# Altium schematic sheet GU906_HW_V1.0.SchDoc
size A4
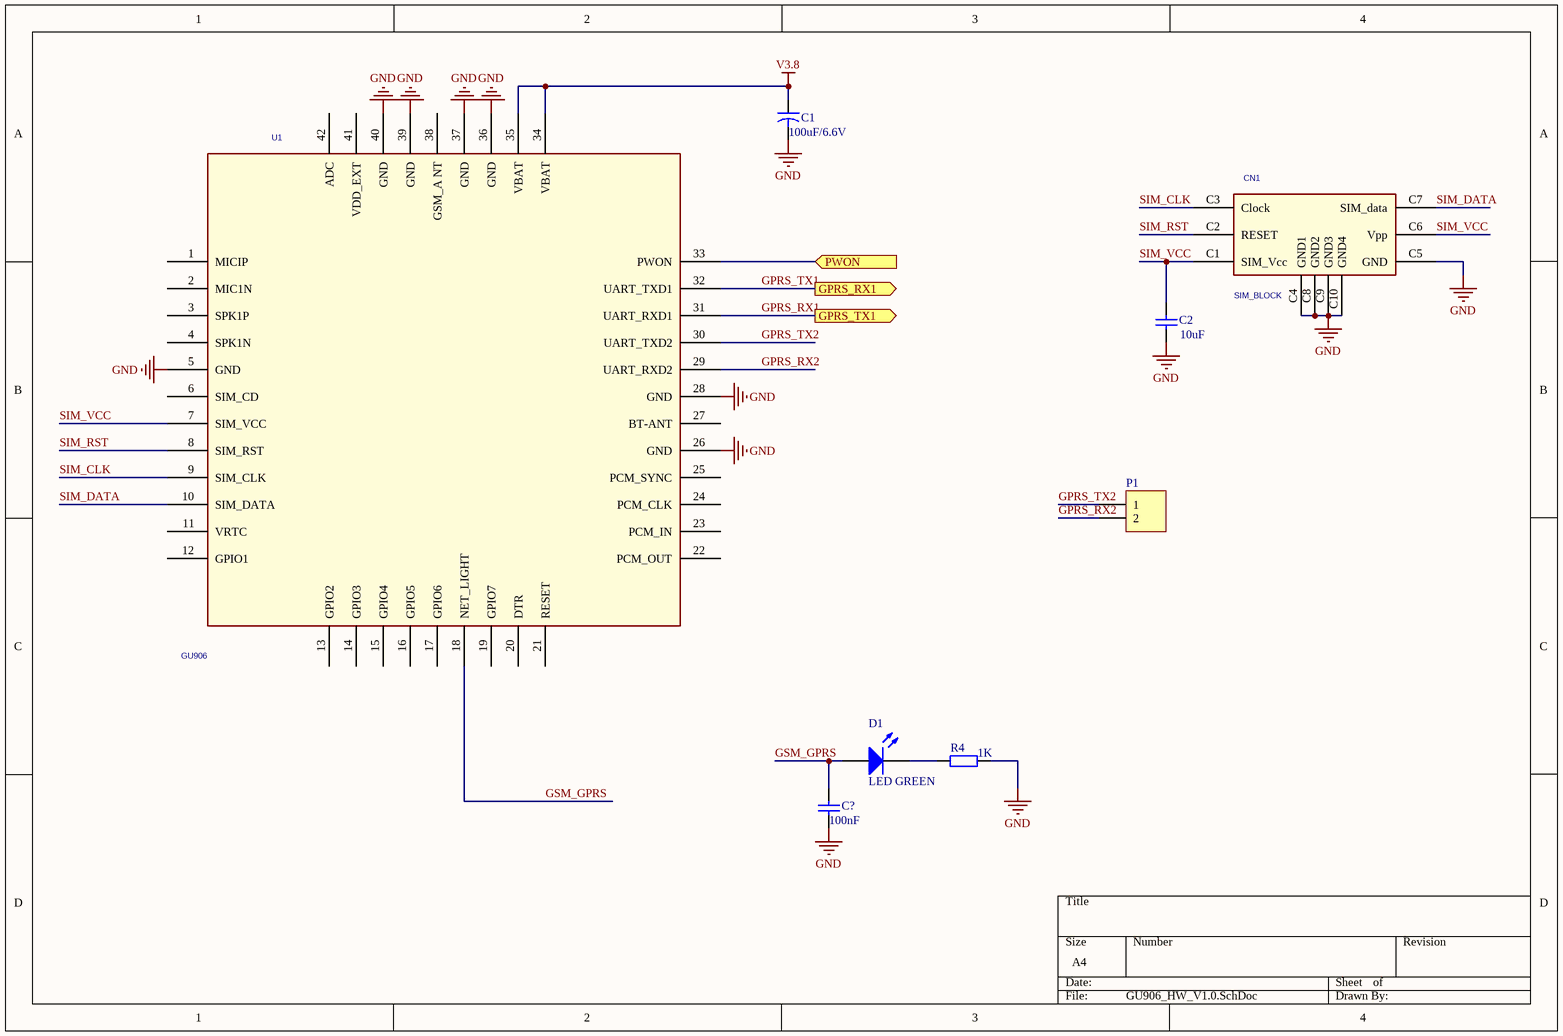
[diagram p0: GU906_HW_V1.0.SchDoc]

## Parts
C1  value 100uF/6.6V  [CAPR5-4X5]  (hidden comment: Cap2)
C2  value 10uF  [RAD-0.3]  (hidden comment: Cap)
C?  value 100nF  [RAD-0.3]  (hidden comment: Cap)
CN1  SIM_BLOCK  [SIM_BLOCK]
D1  LED GREEN  [3.2X1.6X1.1]
P1  Header 2  [HDR1X2]  (value not drawn)
R4  value 1K  [AXIAL-0.4]  (hidden comment: Res2)
U1  GU906  [HFY_QFN_42_DTU]

## Ports
GPRS_RX1 (out), GPRS_TX1 (out), PWON (in)

## Nets
GND: C1.2 C2.1 C?.1 CN1.C4(GND1) CN1.C5(GND) CN1.C8(GND2) CN1.C9(GND3) CN1.C10(GND4) R4.2 U1.5(GND) U1.26(GND) U1.28(GND) U1.36(GND) U1.37(GND) U1.39(GND) U1.40(GND)
V3.8: C1.1 U1.34(VBAT) U1.35(VBAT)
GPRS_RX1: U1.31(UART_RXD1) ; port GPRS_TX1
GPRS_RX2: P1.2 U1.29(UART_RXD2)
GPRS_TX1: U1.32(UART_TXD1) ; port GPRS_RX1
GPRS_TX2: P1.1 U1.30(UART_TXD2)
GSM_GPRS: C?.2 D1.1(A) U1.18(NET_LIGHT)
PWON: U1.33(PWON) ; port PWON
SIM_CLK: CN1.C3(Clock) U1.9(SIM_CLK)
SIM_DATA: CN1.C7(SIM_data) U1.10(SIM_DATA)
SIM_RST: CN1.C2(RESET) U1.8(SIM_RST)
SIM_VCC: C2.2 CN1.C1(SIM_Vcc) CN1.C6(Vpp) U1.7(SIM_VCC)
NetD1_2: D1.2(K) R4.1

Not connected (* = marked no-connect by the designer): U1 1(MICIP) 2(MIC1N) 3(SPK1P) 4(SPK1N) 6(SIM_CD) 11(VRTC) 12(GPIO1) 13(GPIO2) 14(GPIO3) 15(GPIO4) 16(GPIO5) 17(GPIO6) 19(GPIO7) 20(DTR) 21(RESET) 22(PCM_OUT) 23(PCM_IN) 24(PCM_CLK) 25(PCM_SYNC) 27(BT-ANT) 38(GSM_A_NT) 41(VDD_EXT) 42(ADC)

## Library data of the parts
C1 = Cap2: Capacitor; Published: 23-Sep-2002; PackageReference: CAPR5-4X5; Publisher: Altium Limited; PackageDescription: Capacitor; 2 Leads
C2 C? = Cap: Capacitor; Published: 8-Jun-2000; LatestRevisionDate: 17-Jul-2002; LatestRevisionNote: Re-released for DXP Platform.; PackageReference: RAD-0.3; Publisher: Altium Limited; PackageDescription: Radial Cap, Thru-Hole; 2 Leads; 0.3 in Pin Spacing
CN1 = SIM_BLOCK_2
D1 = LED2: Typical RED, GREEN, YELLOW, AMBER GaAs LED; Published: 8-Jun-2000; LatestRevisionDate: 17-Jul-2002; LatestRevisionNote: Re-released for DXP Platform.; PackageVersion: Feb-2002; PackageReference: 3.2X1.6X1.1; Publisher: Altium Limited; PackageDescription: SM LED; 2 Flat Leads
P1 = Header 2: Header, 2-Pin; LatestRevisionDate: 17-Jul-2002; LatestRevisionNote: Re-released for DXP Platform.; Publisher: Altium Limited
R4 = Res2: Resistor; Published: 8-Jun-2000; LatestRevisionDate: 17-Jul-2002; LatestRevisionNote: Re-released for DXP Platform.; PackageReference: AXIAL-0.4; Publisher: Altium Limited; PackageDescription: Axial Device, Thru-Hole; 2 Leads; 0.4 in Pin Spacing
U1 = GU600_LIB_2